# Altium schematic sheet Relay.SchDoc
size A
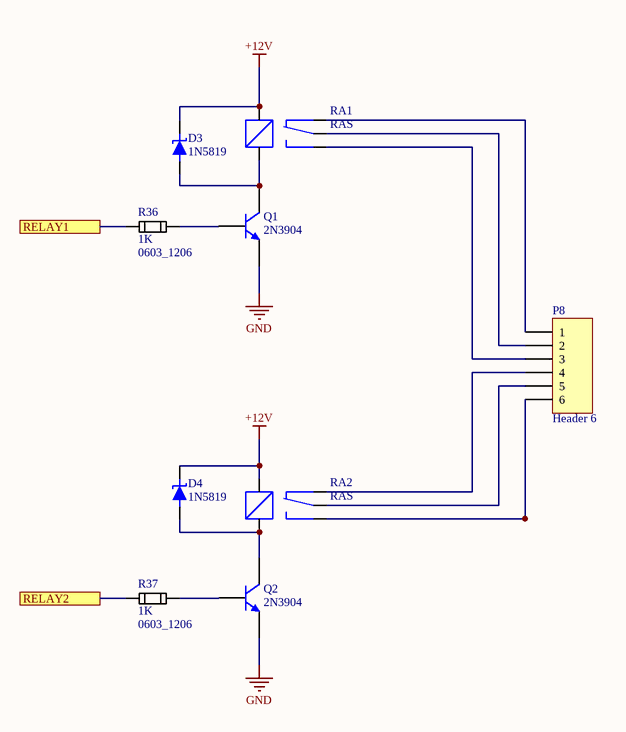
[diagram p0: Relay.SchDoc]

## Parts
D3  1N5819  [DO-41-300]
D4  1N5819  [DO-41-300]
P8  Header 6  [KF2EDGV/R-6P]
Q1  2N3904  [TO-92A-Pitch100MILS]
Q2  2N3904  [TO-92A-Pitch100MILS]
R36  1K  value 0603_1206  [SMD_CHIP_RESISTOR_0603_TO_1206]
R37  1K  value 0603_1206  [SMD_CHIP_RESISTOR_0603_TO_1206]
RA1  RAS  [Rele RAS]
RA2  RAS  [Rele RAS]

## Ports
RELAY1, RELAY2

## Nets
+12V: D3.2(K) D4.2(K) RA1.1(a) RA2.1(a)
GND: Q1.1(E) Q2.1(E)
RELAY1: R36.2 ; port RELAY1
RELAY2: R37.2 ; port RELAY2
NetD3_1: D3.1(A) Q1.3(C) RA1.2(b)
NetD4_1: D4.1(A) Q2.3(C) RA2.2(b)
NetP8_1: P8.1 RA1.3(NC)
NetP8_2: P8.2 RA1.4(O)
NetP8_3: P8.3 RA1.5(NO)
NetP8_4: P8.4 RA2.3(NC)
NetP8_5: P8.5 RA2.4(O)
NetP8_6: P8.6 RA2.5(NO)
NetQ1_2: Q1.2(B) R36.1
NetQ2_2: Q2.2(B) R37.1

## Library data of the parts
D3 D4 = 1N5819: 40V 1A; Price: 0.07
P8 = Header 6: Header, 6-Pin; LatestRevisionDate: 17-Jul-2002; LatestRevisionNote: Re-released for DXP Platform.; Publisher: Altium Limited
Q1 Q2 = 2N3904: NPN General Purpose Amplifier; Published: 8-Jun-2000; LatestRevisionDate: 15-Jan-2003; LatestRevisionNote: PCB Footprint 'BCY-W3/D4.7' replaced; DatasheetVersion: 1997; PackageVersion: Sep-1998; PackageReference: TO-92A; Publisher: Altium Limited; PackageDescription: TO, Flat Index; 3 In-Line, Axial Leads; Body Dia. 4.5mm; Leads 0.51 x 0.48 mm (max); ComponentLink1Description: Manufacturer Link; ComponentLink1URL: http://www.fairchildsemi.com/; ComponentLink2Description: Datasheet; ComponentLink2URL: http://www.fairchildsemi.com/ds/2N%2F2N3904.pdf
R36 R37 = SMD_CHIP_RESISTOR_0603_TO_1206
RA1 RA2 = Relay RAS: AC-120V 15A DC-14V 20A 30V 15A /0.36W; Price: 1.8